# Altium project Radar.PrjPcb
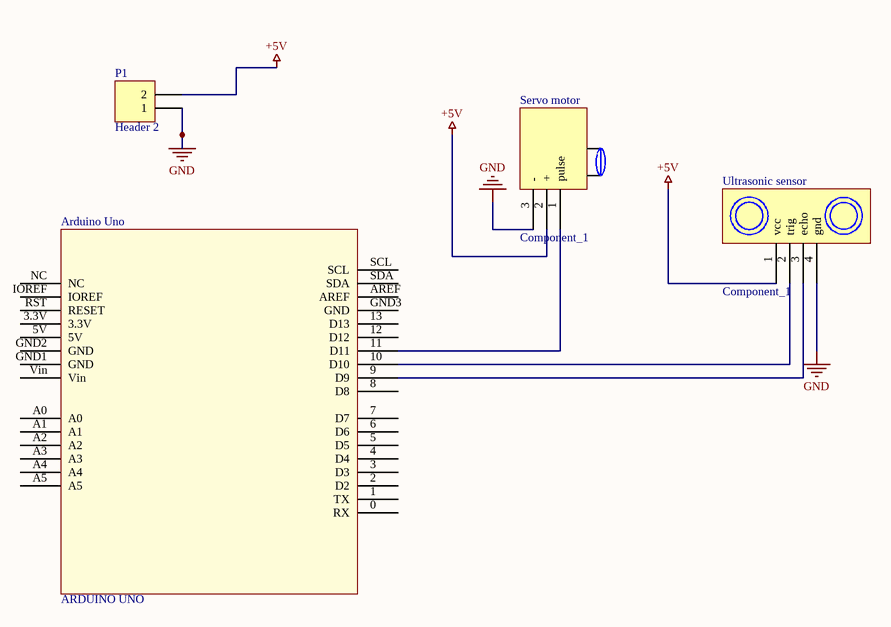
[diagram p0: Sheet1.SchDoc]
1 sheet, 4 parts. Net scope: global (net labels, ports and power ports of the same name join across sheets).
Board files: AT long bus (13.3 x 4.2 inches).PCBDOC, RADAREXP3PCB1.PcbDoc

## Sheet Sheet1.SchDoc
size A4

### Parts
Arduino_Uno  ARDUINO UNO  [ARDUINO UNO]
P1  Header 2  [HDR1X2]
Servo_motor  Component_1  [PCBComponent_1]
Ultrasonic_sensor  Component_1  [PCBComponent_1]

### Nets
+5V: P1.2 Servo_motor.2(+) Ultrasonic_sensor.1(vcc)
GND: P1.1 Servo_motor.3(-) Ultrasonic_sensor.4(gnd)
NetArduino_Uno_9: Arduino_Uno.9(D9) Ultrasonic_sensor.3(echo)
NetArduino_Uno_10: Arduino_Uno.10(D10) Ultrasonic_sensor.2(trig)
NetArduino_Uno_11: Arduino_Uno.11(D11) Servo_motor.1(pulse)

Not connected (* = marked no-connect by the designer): Arduino_Uno 0(RX) 1(TX) 2(D2) 3(D3) 3.3V 4(D4) 5(D5) 5V 6(D6) 7(D7) 8(D8) 12(D12) 13(D13) A0 A1 A2 A3 A4 A5 AREF GND1(GND) GND2(GND) GND3(GND) IOREF NC RST(RESET) SCL SDA Vin

### Library data of the parts
P1 = Header 2: Header, 2-Pin; LatestRevisionDate: 17-Jul-2002; LatestRevisionNote: Re-released for DXP Platform.; Publisher: Altium Limited